# Altium schematic sheet Sheet1.SchDoc: MSP430 GPRS
size A4